# EAGLE design GasSensor Shield v1 (EAGLE 5.11)

## Sheet 1 of 2
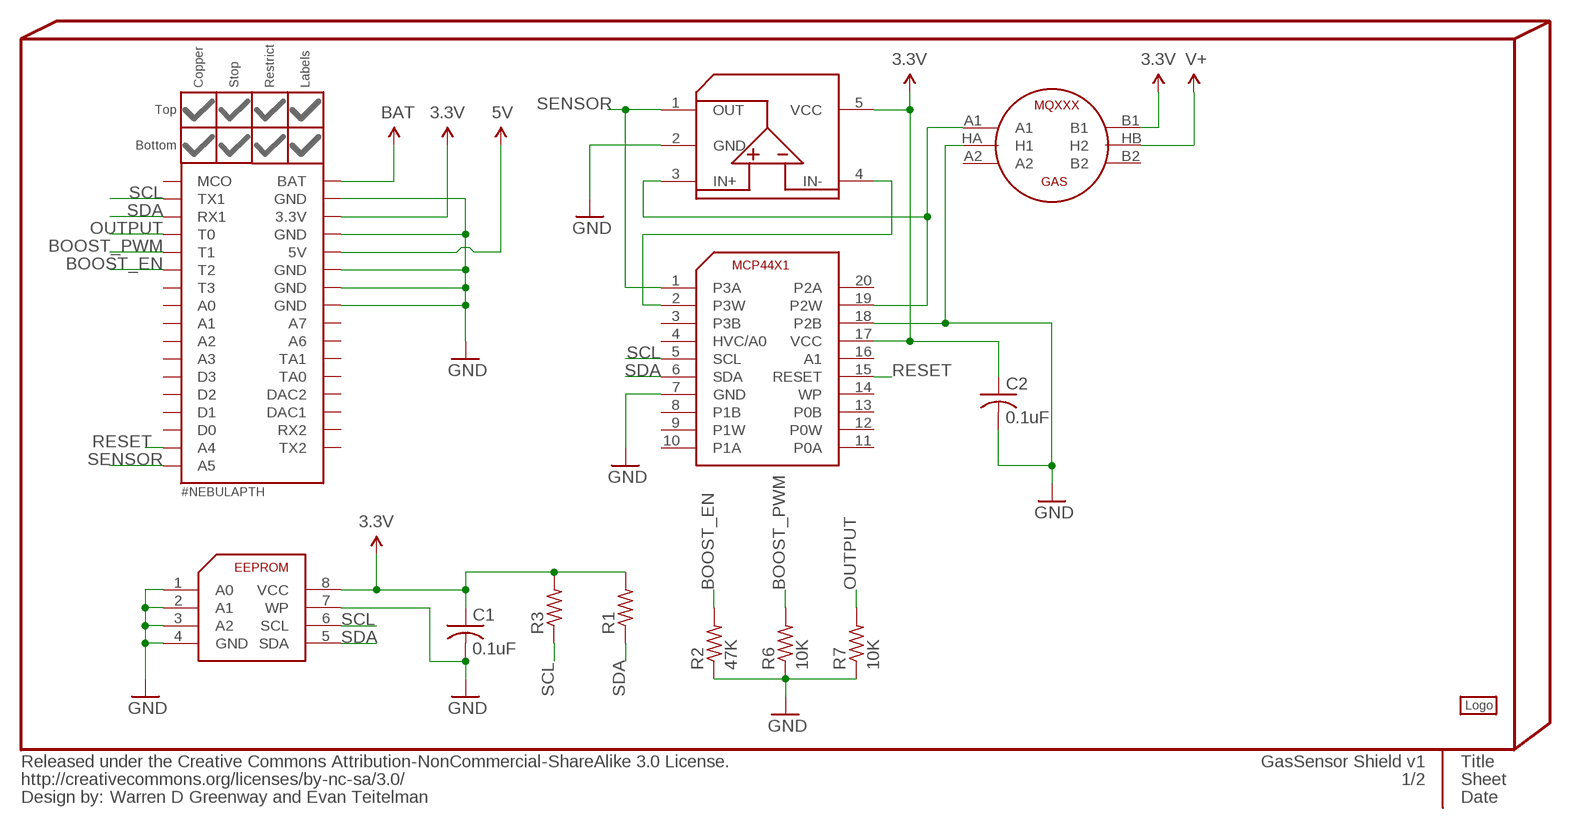
[diagram p0: schematic, sheet 1]

### Parts
C1  0.1uF  C-USC0402  [C0402]
C2  0.1uF  C-USC0402  [C0402]
INFO2  Warren D Greenway and Evan Teitelman  %CC-NC-SA  [%CC-NC-SA]
LOGO1  #LOGOA-THICK  [#LOGOA-THICK]
NEBULA1  #NEBULAPTH  [#NEBULA-PTH]
NEBULAPART1  #NEBULA-PARTLABELS-BOTTOM  [#NEBULA-LABELS-BOTT]
R1  R-US_R0402  [R0402]
R2  47K  R-US_R0402  [R0402]
R3  R-US_R0402  [R0402]
R6  10K  R-US_R0402  [R0402]
R7  10K  R-US_R0402  [R0402]
U2  SENSOR-GAS-MQXXX  [MQ-3]
U3  EEPROM-ATMEL-AT24HC02B  [TSSOP8]
U4  DIGIPOT-MCP44X1  [TSSOP20]
U5  OPAMP-ST-LMV321RILT  [SOT23-5L]

### Nets
3.3V: C1.1 C2.1 NEBULA1.3.3V R1.2 R3.2 U2.B1 U3.8(VCC) U4.17(VCC) U5.5(VCC) ; supply symbol labelled @3.3V
5V: NEBULA1.5V ; supply symbol labelled @5V ; also sheet 2
BAT: NEBULA1.BAT ; supply symbol labelled @BAT ; also sheet 2
BOOST_EN: NEBULA1.T2 R2.2 ; also sheet 2
BOOST_PWM: NEBULA1.T1 R6.2 ; also sheet 2
GND: C1.2 C2.2 NEBULA1.GND1(GND) NEBULA1.GND2(GND) NEBULA1.GND3(GND) NEBULA1.GND4(GND) NEBULA1.GND5(GND) R2.1 R6.1 R7.1 U2.HA(H1) U3.1(A0) U3.2(A1) U3.3(A2) U3.4(GND) U3.7(WP) U4.7(GND) U4.18(P2B) U5.2(GND) ; supply symbol labelled @GND ; also sheet 2
N$2: U4.2(P3W) U5.4(IN-)
N$3: U2.A1 U4.19(P2W) U5.3(IN+)
OUTPUT: NEBULA1.T0 R7.2 ; also sheet 2
RESET: NEBULA1.A4 U4.15(RESET)
SCL: NEBULA1.COM1_TX(TX1) R3.1 U3.6(SCL) U4.5(SCL)
SDA: NEBULA1.COM1_RX(RX1) R1.1 U3.5(SDA) U4.6(SDA)
SENSOR: NEBULA1.A5 U4.1(P3A) U5.1(OUT)
V+: U2.HB(H2) ; supply symbol labelled @V+ ; also sheet 2
Unconnected: NEBULA1.A0 NEBULA1.A1 NEBULA1.A2 NEBULA1.A3 NEBULA1.A6 NEBULA1.A7 NEBULA1.COM2_RX(RX2) NEBULA1.COM2_TX(TX2) NEBULA1.D0 NEBULA1.D1 NEBULA1.D2 NEBULA1.D3 NEBULA1.DAC1 NEBULA1.DAC2 NEBULA1.MCO NEBULA1.T3 NEBULA1.TA0 NEBULA1.TA1 U2.A2 U2.B2 U4.3(P3B) U4.4(HVC/A0) U4.8(P1B) U4.9(P1W) U4.10(P1A) U4.11(P0A) U4.12(P0W) U4.13(P0B) U4.14(WP) U4.16(A1) U4.20(P2A)

## Sheet 2 of 2
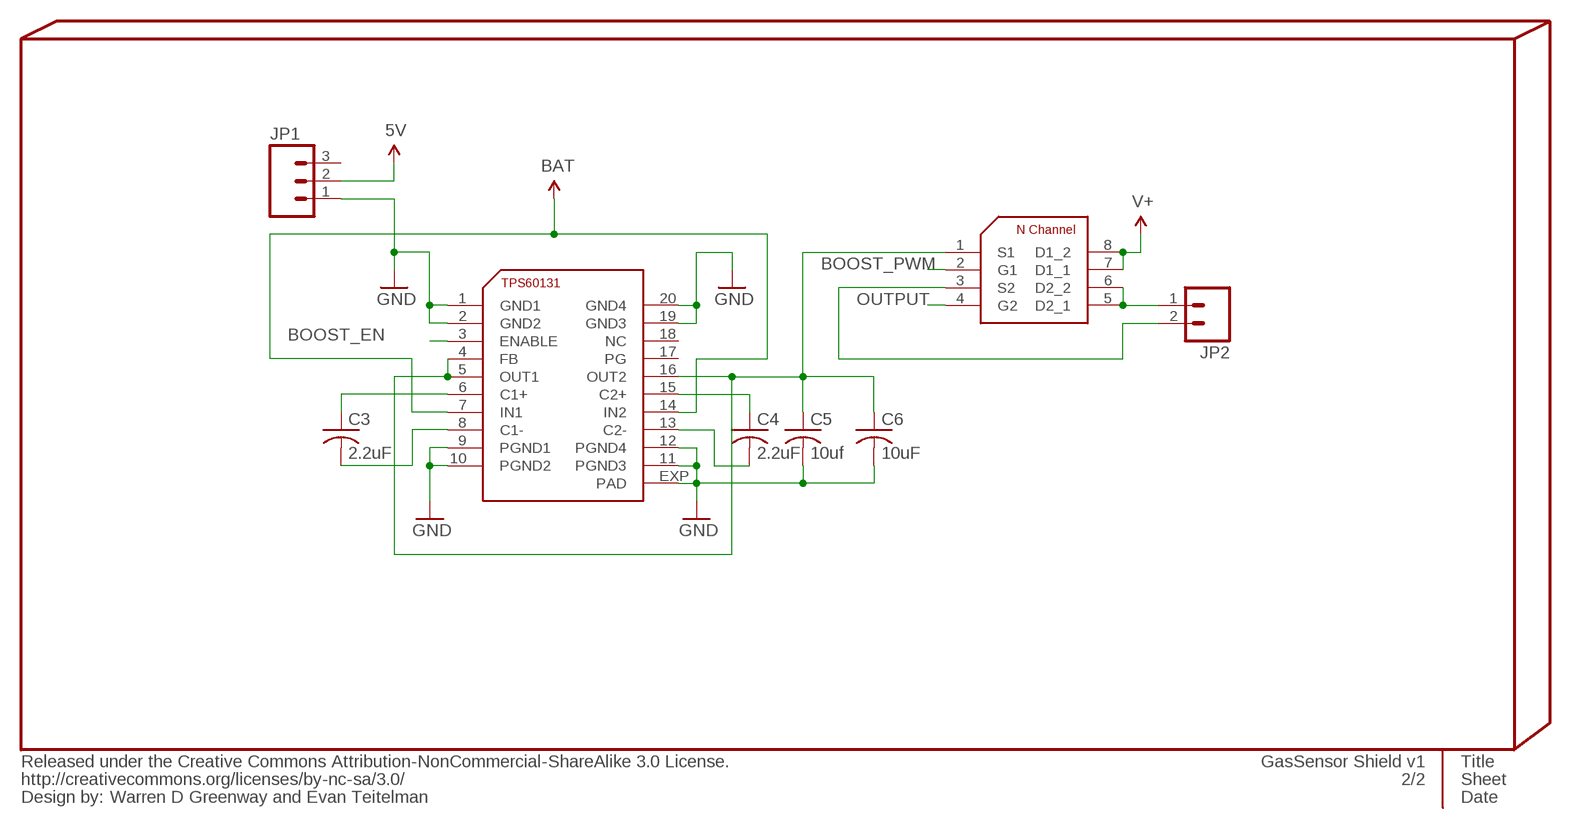
[diagram p1: schematic, sheet 2]

### Parts
C3  2.2uF  C-USC0603  [C0603]
C4  2.2uF  C-USC0603  [C0603]
C5  10uf  C-USC0805  [C0805]
C6  10uF  C-USC0805  [C0805]
JP1  M03PTH  [1X03]
JP2  M02PTH  [1X02]
U6  REGULATOR-TI-60131  [HTSSOP20PWP]
U7  TRANSISTOR-VISHAY-SI7288DP  [SOIC8]

### Nets
5V: JP1.2 ; supply symbol labelled @5V ; also sheet 1
BAT: U6.7(IN1) U6.14(IN2) ; supply symbol labelled @BAT ; also sheet 1
BOOST_EN: U6.3(ENABLE) ; also sheet 1
BOOST_PWM: U7.2(G1) ; also sheet 1
GND: C5.2 C6.2 JP1.1 U6.1(GND1) U6.2(GND2) U6.9(PGND1) U6.10(PGND2) U6.11(PGND3) U6.12(PGND4) U6.19(GND3) U6.20(GND4) U6.EXP(PAD) ; supply symbol labelled @GND ; also sheet 1
N$12: C5.1 C6.1 U6.4(FB) U6.5(OUT1) U6.16(OUT2) U7.1(S1)
N$13: C4.2 U6.13(C2-)
N$15: C4.1 U6.15(C2+)
N$16: C3.1 U6.6(C1+)
N$17: C3.2 U6.8(C1-)
N$18: JP2.1 U7.5(D2_1) U7.6(D2_2)
N$21: JP2.2 U7.3(S2)
OUTPUT: U7.4(G2) ; also sheet 1
V+: U7.7(D1_1) U7.8(D1_2) ; supply symbol labelled @V+ ; also sheet 1
Unconnected: JP1.3 U6.17(PG) U6.18(NC)

## Library data of the parts
C1-C6 = rcl:C-US: CAPACITOR, American symbol
INFO2 = PygmyBoards:%CC-NC-SA: Released under the Creative Commons Attribution-NonCommercial-ShareAlike 3.0 License. http://creativecommons.org/licenses/by-sa/3.0 Design by: [Designer Name] Change this part's value to change the designer name
JP1 = Pygmy:M03: Header 3 Standard 3-pin 0.1" header. Use with straight break away headers (SKU : PRT-00116), right angle break away headers (PRT-00553), swiss pins (PRT-00743), machine pins (PRT-00117), and female headers (PRT-00115). Molex polarized connector foot print use with SKU : PRT-08232 with associated crimp pins and housings.
JP2 = Pygmy:M02: Header 2 Standard 2-pin 0.1" header. Use with straight break away headers (SKU : PRT-00116), right angle break away headers (PRT-00553), swiss pins (PRT-00743), machine pins (PRT-00117), and female headers (PRT-00115). Molex polarized connector foot print use with SKU : PRT-08233 with associated crimp pins and housings.
LOGO1 = PygmyBoards:#LOGO
NEBULA1 = PygmyBoards:#NEBULA: Nebula Board and Shield Footprint Pads This is the only absolutely required part for the footprint. The parts in "#NEBULA-PART" are merely aesthetic. A circular board outline should be .001" thick and 1.005" in diameter (Reference circle on the Document (48) layer provided).
NEBULAPART1 = PygmyBoards:#NEBULA-PART: Nebula Board and Shield Footprint Parts These parts are only functional when combined with the pads in "#NEBULA".
R1-R3 R6 R7 = rcl:R-US_: RESISTOR, American symbol
U2 = Pygmy:SENSOR-GAS-MQXXX
U3 = Pygmy:EEPROM-ATMEL-AT24HC02B
U4 = Pygmy:DIGIPOT-MCP44X1
U5 = Pygmy:OPAMP-ST-LMV321RILT
U6 = Pygmy:REGULATOR-TI-60131
U7 = Pygmy:TRANSISTOR-VISHAY-SI7288DP

## Board
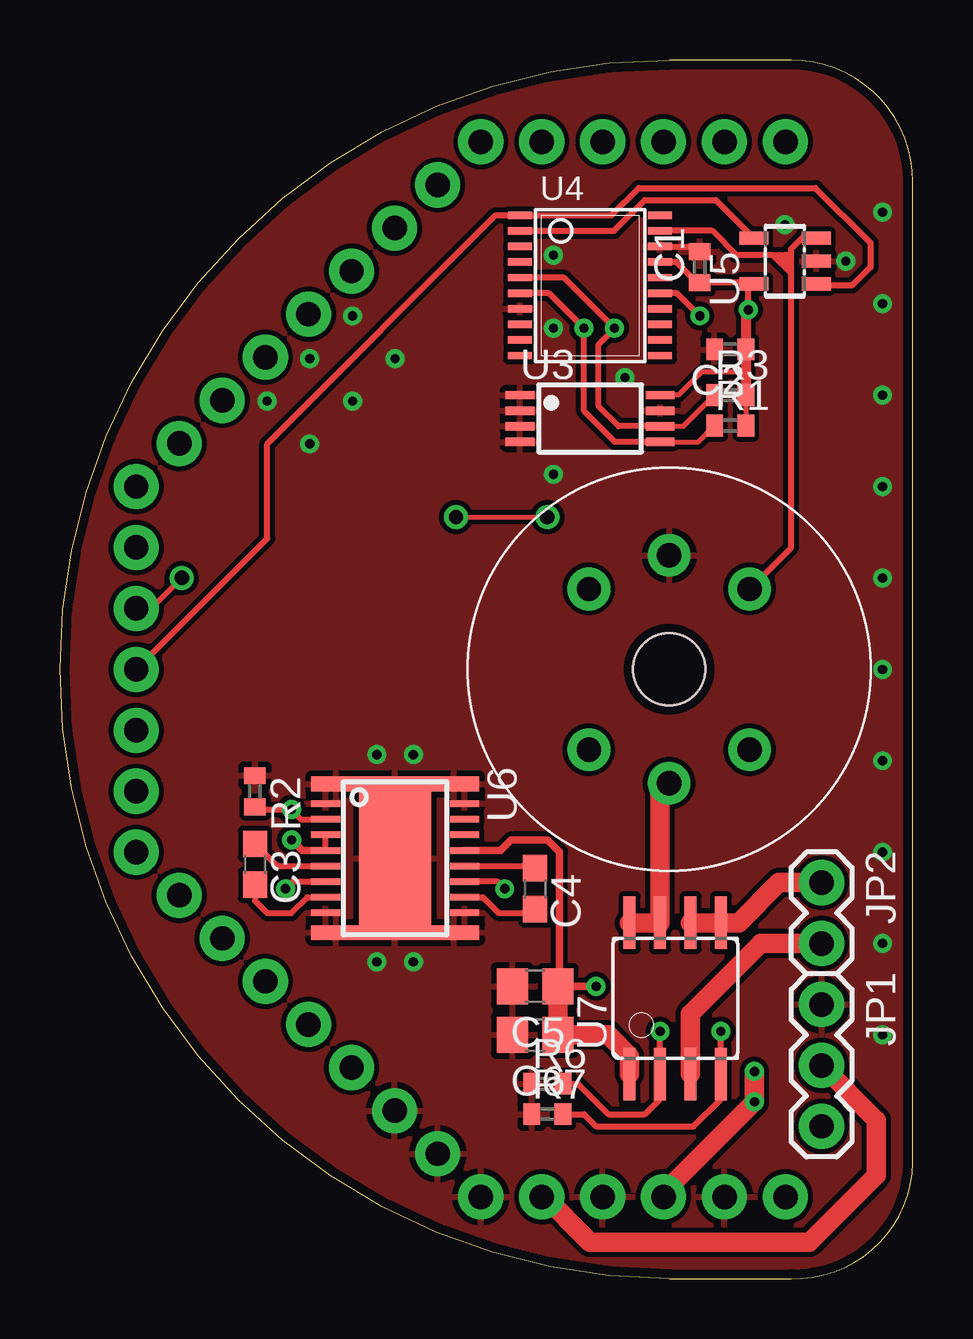
[diagram p2: board, top side]
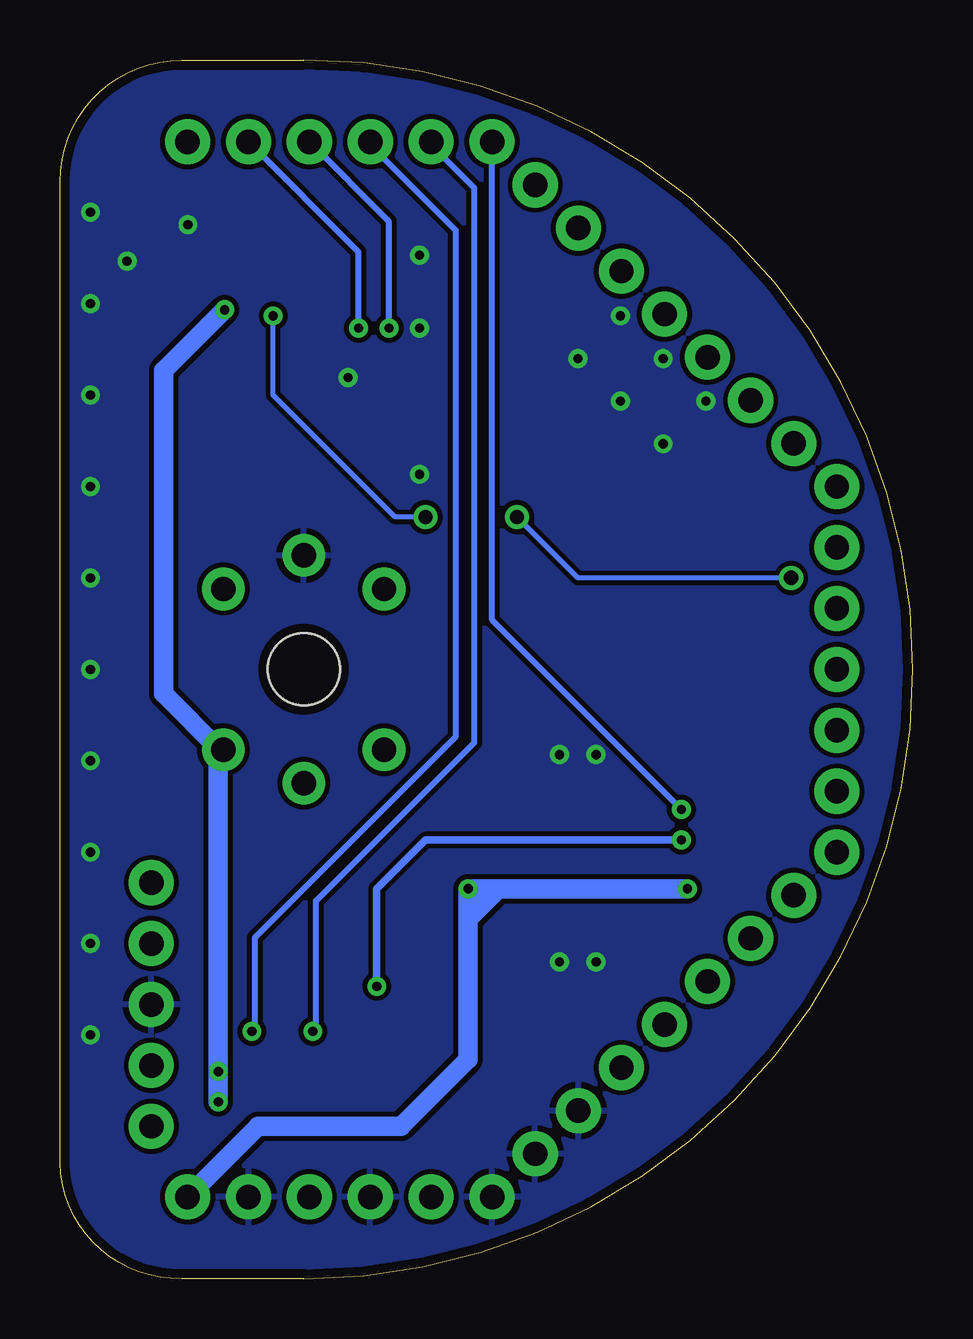
[diagram p3: board, bottom side, seen from below]

Size 35.56 x 50.8 mm. Coordinates in mm from the lower left corner, seen from the top.
Outline: 25.4,0 arc-180 25.4,50.8 30.48,50.8 arc-90 35.56,45.72 35.56,4.83 arc-90 30.48,0 25.4,0
Copper layers (1*16): Top 0.035mm / dielectric 1.5mm / Bottom 0.035mm
Design rules "PDX (Production)": minimum track width 6mil, minimum drill 15mil, track to track 6mil, track to pad 6mil, pad to pad 4mil, via to via 6mil, smd to smd 4mil, copper to edge 15mil, drill to drill 6mil, minimum pad ring 10mil, minimum via ring 8mil, stop-mask expansion 4mil, vias tented up to drill 25mil, thermal gap 10mil

### Footprints (pad centres in the part's own frame; a part is rotated, then mirrored left to right if it is on the bottom)
C0402 = smd 0.7 x 0.9: 1 -0.65,0; 2 0.65,0
C0603 = smd 1.1 x 1: 1 -0.85,0; 2 0.85,0
C0805 = smd 1.3 x 1.5: 1 -0.95,0; 2 0.95,0
1X03 = drill 1.016 pad 1.88 round: 1 0,0; 2 2.54,0; 3 5.08,0
1X02 = drill 1.016 pad 1.88 round: 1 0,0; 2 2.54,0
#NEBULA-PTH@1 = drill 1.016 pad 1.88 round: 3.3V -25.637,-47.388; 5V -30.716,-47.388; A0 -36.848,-7.004; A1 -38.645,-8.8; A2 -40.44,-10.596; A3 -42.237,-12.392; A4 -47.625,-22.86; A5 -47.625,-25.4; A6 -40.44,-40.204; A7 -38.645,-42; BAT -20.557,-47.388; COM1_RX -25.636,-3.412; COM1_TX -23.096,-3.412; COM2_RX -47.625,-30.48; COM2_TX -47.625,-27.94; D0 -47.625,-20.32; D1 -47.625,-17.78; D2 -45.829,-15.984; D3 -44.032,-14.188; DAC1 -47.625,-33.02; DAC2 -45.829,-34.816; GND1 -36.848,-43.796; GND2 -35.052,-45.592; GND3 -33.256,-47.388; GND4 -28.177,-47.388; GND5 -23.097,-47.388; MCO -20.556,-3.412; T0 -28.176,-3.412; T1 -30.716,-3.412; T2 -33.256,-3.412; T3 -35.052,-5.208; TA0 -44.032,-36.612; TA1 -42.237,-38.408
R0402 = smd 0.7 x 0.9: 1 -0.65,0; 2 0.65,0
MQ-3 = drill 1.016 pad 1.778 round: A1 -3.35,3.35; A2 -3.35,-3.35; B1 3.35,3.35; B2 3.35,-3.35; HA -4.75,0; HB 4.75,0 | hole 3: 0,0
TSSOP8 = smd 1.2 x 0.35: 1 -2.925,0.975; 2 -2.925,0.325; 3 -2.925,-0.325; 4 -2.925,-0.975; 5 2.925,-0.975; 6 2.925,-0.325; 7 2.925,0.325; 8 2.925,0.975
TSSOP20 = smd 0.305 x 0.991: 1 -2.925,-2.918; 2 -2.275,-2.918; 3 -1.625,-2.918; 4 -0.975,-2.918; 5 -0.325,-2.918; 6 0.325,-2.918; 7 0.975,-2.918; 8 1.625,-2.918; 9 2.275,-2.918; 10 2.925,-2.918; 11 2.925,2.918; 12 2.275,2.918; 13 1.625,2.918; 14 0.975,2.918; 15 0.325,2.918; 16 -0.325,2.918; 17 -0.975,2.918; 18 -1.625,2.918; 19 -2.275,2.918; 20 -2.925,2.918
SOT23-5L = smd 0.55 x 1.2: 1 -0.95,-1.3; 2 0,-1.3; 3 0.95,-1.3; 4 0.95,1.3; 5 -0.95,1.3
HTSSOP20PWP = smd 0.61 x 2.1: 1 -3.095,-2.45; 10 3.095,-2.45; 11 3.095,2.45; 20 -3.095,2.45 | smd 0.27 x 1.2: 2 -2.275,-2.9; 3 -1.625,-2.9; 4 -0.975,-2.9; 5 -0.325,-2.9; 6 0.325,-2.9; 7 0.975,-2.9; 8 1.625,-2.9; 9 2.275,-2.9; 12 2.275,2.9; 13 1.625,2.9; 14 0.975,2.9; 15 0.325,2.9; 16 -0.325,2.9; 17 -0.975,2.9; 18 -1.625,2.9; 19 -2.275,2.9 | smd 6.8 x 3: EXP 0,0
SOIC8 = smd 0.5 x 2.2: 1 -1.905,-3.154; 2 -0.645,-3.154; 3 0.625,-3.154; 4 1.895,-3.154; 5 1.905,3.154; 6 0.635,3.154; 7 -0.635,3.154; 8 -1.905,3.154

### Placement (x,y rotation side)
C1  26.67,42.16 90 top
C2  27.94,38.73 180 top
C3  8.13,17.27 270 top
C4  19.81,16.26 270 top
C5  19.81,12.19 180 top
C6  19.81,10.16 180 top
INFO2  -2.54,-10.16 0 top  (outside the outline)
JP1  31.75,11.43 270 top
JP2  31.75,16.51 270 top
LOGO1  10.8,29.21 270 top
NEBULA1  #NEBULAPTH  [#NEBULA-PTH@1]  50.8,50.8 0 top
NEBULAPART1  50.8,50.8 0 top  (outside the outline)
R1  27.94,35.56 0 top
R2  8.13,20.32 270 top
R3  27.94,36.83 0 top
R6  20.32,8.13 0 top
R7  20.32,6.86 0 top
U2  25.4,25.4 270 top
U3  22.1,35.86 0 top
U4  22.1,41.4 270 top
U5  30.23,42.42 90 top
U6  13.97,17.53 270 top
U7  25.65,11.68 0 top

### Tracks (layer width: path | path; a pad name or v marks a point on that pad's centre or on a via)
3.3V  (via drill 0.38)
  Top 0.203: R3.2 R1.2 | U3.8 25.78,36.83 26.75,37.8 28.46,37.8 28.59,37.67
  Top 0.254: U5.5 28.86,41.4 29.21,41.4 | U5.5 28.92,41.48 | v28.7,40.39 28.7,41.24 U5.5 | U4.17 25.7,42.38 26.42,41.66 26.53,41.66 C1.1 28.88,41.51 U5.5
  Top 0.406: v28.7,40.39 28.59,40.27 C2.1 28.59,37.67 R3.2
  Top 0.813: NEBULA1.3.3V 25.16,3.57 v28.96,7.37 v28.96,8.64
  Bottom 0.813: v28.96,7.37 v28.96,8.64 28.96,21.84 U2.B1 28.91,22.05 31.24,24.38 31.24,37.85 v28.7,40.39
5V
  Top 0.813: NEBULA1.5V 20.08,3.54 22.1,1.52 31.24,1.52 34.04,4.32 34.04,6.6 JP1.2
BAT  (via drill 0.38)
  Top 0.254: U6.7 9.69,16.55 v9.4,16.26 | U6.14 18.25,16.55 v18.54,16.26
  Bottom 0.813: 18.54,14.99 v18.54,16.26 17.27,16.26 | 18.54,14.99 18.54,9.14 21.34,6.35 27.3,6.35 NEBULA1.BAT | v9.4,16.26 17.27,16.26 | 17.27,16.26 18.54,14.99
BOOST_EN  (via drill 0.38)
  Top 0.254: U6.3 10.06,19.15 v9.65,19.56 8.24,19.56 R2.2
  Bottom 0.254: NEBULA1.T2 17.54,27.45 v9.65,19.56
BOOST_PWM  (via drill 0.38)
  Top 0.254: U7.2 25.01,7.48 24.38,6.86 22.86,6.86 21.59,8.13 R6.2 | U7.2 24.99,8.55 | v25.02,10.31 U7.2
  Bottom 0.254: NEBULA1.T1 20.08,47.26 18.29,45.47 18.29,22.35 24.89,15.75 24.89,10.44 v25.02,10.31
GND  (via drill 0.38)
  Top 0.254: U4.18 26.46,43.03 C1.2
  other vias: 34.29,10.16 13.97,38.35 10.41,34.8 13.21,21.84 14.73,21.84 20.57,39.62 12.19,36.58 20.57,42.67 12.19,40.13 8.64,36.58 10.41,38.35 32.77,42.42 20.57,33.53 30.23,43.94 13.21,13.21 14.73,13.21 34.29,44.45 34.29,40.64 34.29,36.83 34.29,33.02 34.29,29.21 34.29,25.4 34.29,21.59 34.29,17.78 34.29,13.97 23.55,37.57
  pour Bottom (isolate 0.203): -2.54,-2.54 38.1,-2.54 38.1,53.34 -2.54,53.34
  pour Top (isolate 0.203): -1.27,-1.27 36.83,-1.27 36.83,52.07 -1.27,52.07
N$2
  Top 0.254: U4.2 23.1,43.68 24.38,44.96 27.34,44.96 U5.4
N$3
  Top 0.254: U4.19 27.19,43.68 28.19,42.67 29.72,42.67 | 31.49,43.33 U5.3 31.46,43.43 30.99,43.43 30.48,42.93 30.48,42.67 | 30.48,42.67 30.23,42.67 | 29.97,42.67 30.23,42.67 | 29.72,42.67 29.97,42.67 | 30.48,41.91 30.48,30.48 U2.A1 | 30.48,41.91 30.48,42.16 | 30.48,42.16 30.48,42.42 | 30.48,42.42 30.48,42.67 | 30.48,41.91 29.72,42.67 | 30.48,42.42 30.23,42.67 | 30.48,42.16 29.97,42.67
N$12  (via drill 0.38)
  Top 0.254: U6.5 U6.4
  Top 0.305: U6.16 18.36,17.85 18.8,18.29 20.32,18.29 20.83,17.78 20.83,12.26 C5.1 v22.35,12.19 | U6.5 10.09,17.85 v9.65,18.29
  Top 0.813: U7.1 23.75,9.27 22.86,10.16 C6.1 C5.1
  Bottom 0.305: v9.65,18.29 20.32,18.29 22.35,16.26 v22.35,12.19
N$13
  Top 0.254: U6.13 17.63,15.9 18.29,15.24 19.65,15.24 C4.2
N$15
  Top 0.254: U6.15 19.72,17.2 C4.1
N$16
  Top 0.254: U6.6 9.05,17.2 C3.1
N$17
  Top 0.254: U6.8 10.31,15.9 9.65,15.24 8.64,15.24 8.13,15.75 C3.2
N$18
  Top 0.813: U7.6 U7.5 28.3,14.84 29.97,16.51 JP2.1
N$21
  Top 0.813: U7.3 26.28,11.04 29.21,13.97 JP2.2
OUTPUT  (via drill 0.38)
  Top 0.254: R7.2 21.84,6.86 22.35,6.35 26.42,6.35 27.55,7.48 U7.4 v27.56,10.31
  Bottom 0.254: NEBULA1.T0 22.62,47.26 19.05,43.69 19.05,22.61 27.43,14.22 27.43,10.44 v27.56,10.31
RESET  (via drill 0.38, 0.6)
  Top 0.203: NEBULA1.A4 3.81,27.94 v5.08,29.21 | v16.51,31.75 v20.32,31.75
  Top 0.254: U4.15 25.73,41.08 v26.67,40.13
  Bottom 0.203: v5.08,29.21 13.97,29.21 v16.51,31.75 | v20.32,31.75 21.59,31.75 26.67,36.83 v26.67,40.13
SCL  (via drill 0.38)
  Top 0.203: 23.29,35.53 25.99,35.53 R3.1
  Top 0.254: U4.5 21.01,41.73 v23.11,39.62 23.11,39.6 22.45,38.94 22.45,36.37 23.29,35.53 U3.6
  Bottom 0.254: v23.11,39.62 23.11,42.8 NEBULA1.COM1_TX
SDA  (via drill 0.38)
  Top 0.203: 23.13,34.88 26.61,34.88 R1.1
  Top 0.254: U4.6 20.39,41.08 v21.84,39.62 21.84,36.17 23.13,34.88 U3.5
  Bottom 0.254: v21.84,39.62 21.84,44.07 NEBULA1.COM1_RX
SENSOR
  Top 0.254: NEBULA1.A5 8.64,30.86 8.64,34.8 18.16,44.33 U4.1 22.99,44.33 24.13,45.47 31.5,45.47 33.78,43.18 33.78,42.16 33.02,41.4 31.59,41.4 U5.1
V+
  Top 0.813: U7.8 U7.7 25.02,20.27 U2.HB

### Text on the board
tTest: A | D | S | G | 5
bTest: Pygmy Nebula | Warren D Greenway | V1 | Gas Sensor Shield | Evan Teitelman | Design By:
Document: Pygmy GasSensor Shield | Version 1.0 | Standard Grid: 50mil | Routing Grids: 8mil / 4mil